# EasyEDA Pro project Targetold1.eprj

# Schematic Schematic1
Create Date: 2022-10-10; Page Name: P1; Project Name: TargetV1; Schematic Name: Schematic1; Update Date: 2022-10-11
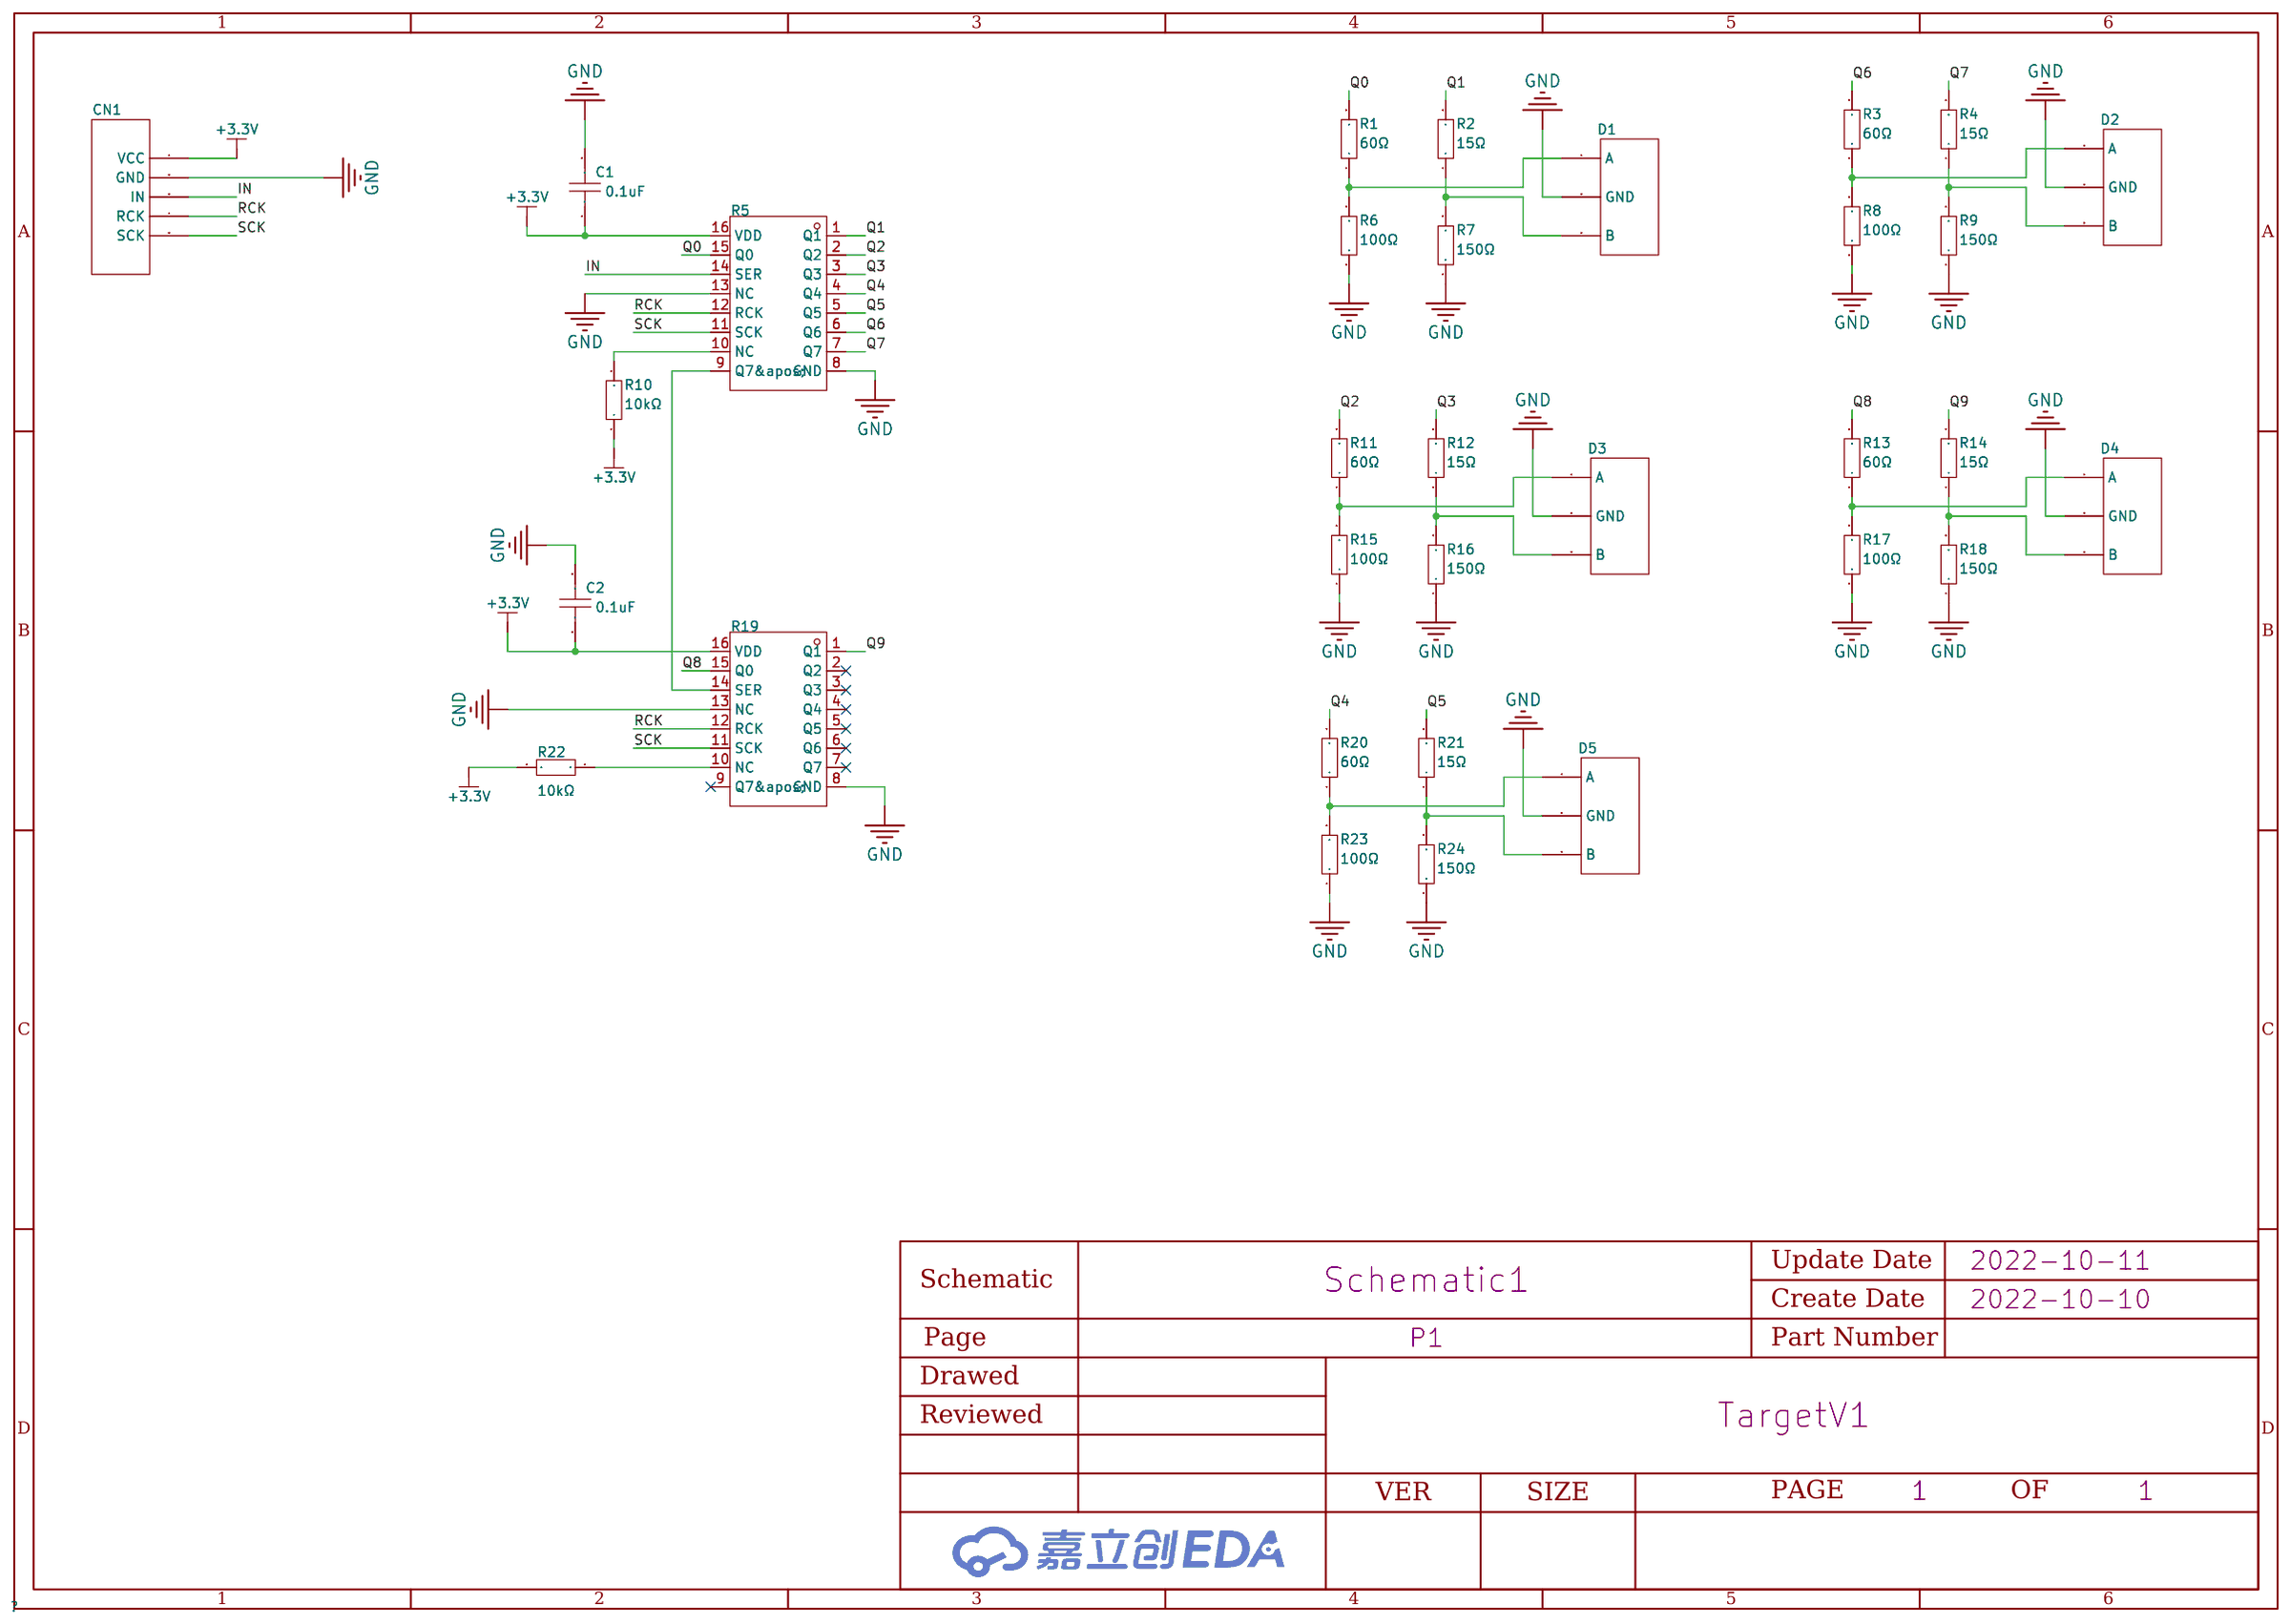
[diagram p0: schematic sheet]

## Parts
C1  0.1uF  [C0603]
C2  0.1uF  [C0603]
CN1  -  [XH2.54-5P]
D1  -  [双色LED-共阴]
D2  -  [双色LED-共阴]
D3  -  [双色LED-共阴]
D4  -  [双色LED-共阴]
D5  -  [双色LED-共阴]
R1  60Ω  [R0603]
R2  15Ω  [R0603]
R3  60Ω  [R0603]
R4  15Ω  [R0603]
R5  74HC595D.  [SOP-16_L9.9-W3.9-P1.27-LS6.0-BL]
R6  100Ω  [R0603]
R7  150Ω  [R0603]
R8  100Ω  [R0603]
R9  150Ω  [R0603]
R10  10kΩ  [R0603]
R11  60Ω  [R0603]
R12  15Ω  [R0603]
R13  60Ω  [R0603]
R14  15Ω  [R0603]
R15  100Ω  [R0603]
R16  150Ω  [R0603]
R17  100Ω  [R0603]
R18  150Ω  [R0603]
R19  74HC595D.  [SOP-16_L9.9-W3.9-P1.27-LS6.0-BL]
R20  60Ω  [R0603]
R21  15Ω  [R0603]
R22  10kΩ  [R0603]
R23  100Ω  [R0603]
R24  150Ω  [R0603]

## Library data of the parts
C1 C2 = CC0603KRX7R9BB104: 容值:100nF;精度:±10%;额定电压:50V;材质(温度系数):X7R;; LCSC Part Name: 100nF ±10% 50V; Supplier Part: C14663; Manufacturer: YAGEO(国巨); Supplier Footprint: 0603; JLCPCB Part Class: Basic Part; Datasheet: https://atta.szlcsc.com/upload/public/pdf/source/20170116/1484561234239.pdf; Supplier: LCSC; Tolerance: ±10%; Voltage Rated: 50V; Temperature Coefficient: X7R
CN1 = XH2.54-5P
D1-D5 = 双色LED-共阴
R1-R4 R6-R18 R20-R24 = 0603WAF1002T5E: 电阻类型:厚膜电阻;阻值:10kΩ;精度:±1%;功率:100mW;温度系数:±100ppm/;最大工作电压:75V;工作温度范围:-55~+155;; LCSC Part Name: 10kΩ ±1% 100mW; Supplier Part: C25804; Manufacturer: UNI-ROYAL(厚声); Supplier Footprint: 0603; JLCPCB Part Class: Basic Part; Datasheet: https://atta.szlcsc.com/upload/public/pdf/source/20200306/C422600_1E6D84923E4A46A82E41ADD87F860B5C.pdf; Supplier: LCSC; Type: 厚膜电阻; Tolerance: ±1%; Power(Watts): 100mW; Temperature Coefficient: ±100ppm/; Overload Voltage (Max): 75V; Operating Temperature Range: -55~+155
R5 R19 = 74HC595D.: Supplier Part: C2929943; Manufacturer: FM(富满); Supplier Footprint: SOP-16; JLCPCB Part Class: Extended Part; Datasheet: https://atta.szlcsc.com/upload/public/pdf/source/20211125/20F1E3849D7C8A7DB346B0C433D530E9.pdf; Supplier: LCSC

## Nets
+3.3V: C1.1 C2.1 CN1.1(VCC) R5.16(VDD) R10.1 R19.16(VDD) R22.2
GND: C1.2 C2.2 CN1.2(GND) D1.2(GND) D2.2(GND) D3.2(GND) D4.2(GND) D5.2(GND) R5.8(GND) R5.13(NC) R6.1 R7.1 R8.1 R9.1 R15.1 R16.1 R17.1 R18.1 R19.8(GND) R19.13(NC) R23.1 R24.1
IN: CN1.3(IN) R5.14(SER)
Q0: R1.2 R5.15(Q0)
Q1: R2.2 R5.1(Q1)
Q2: R5.2(Q2) R11.2
Q3: R5.3(Q3) R12.2
Q4: R5.4(Q4) R20.2
Q5: R5.5(Q5) R21.2
Q6: R3.2 R5.6(Q6)
Q7: R4.2 R5.7(Q7)
Q8: R13.2 R19.15(Q0)
Q9: R14.2 R19.1(Q1)
RCK: CN1.4(RCK) R5.12(RCK) R19.12(RCK)
SCK: CN1.5(SCK) R5.11(SCK) R19.11(SCK)
$1N1102: R5.10(NC) R10.2
$1N1166: R5.9(Q7&apos;) R19.14(SER)
$1N1771: R19.10(NC) R22.1
$1N5350: D1.1(A) R1.1 R6.2
$1N5516: D1.3(B) R2.1 R7.2
$1N6308: D3.1(A) R11.1 R15.2
$1N6309: D3.3(B) R12.1 R16.2
$1N6730: D5.1(A) R20.1 R23.2
$1N6731: D5.3(B) R21.1 R24.2
$1N7312: D2.1(A) R3.1 R8.2
$1N7313: D2.3(B) R4.1 R9.2
$1N7752: D4.1(A) R13.1 R17.2
$1N7753: D4.3(B) R14.1 R18.2

Not connected (* = marked no-connect by the designer): R19 2(Q2)* 3(Q3)* 4(Q4)* 5(Q5)* 6(Q6)* 7(Q7)* 9(Q7&apos;)*

# Board PCB3
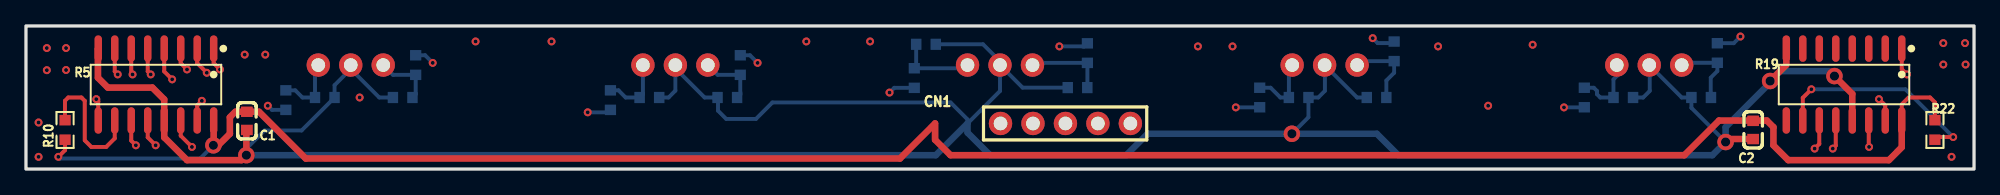
[diagram p1: board, top side]
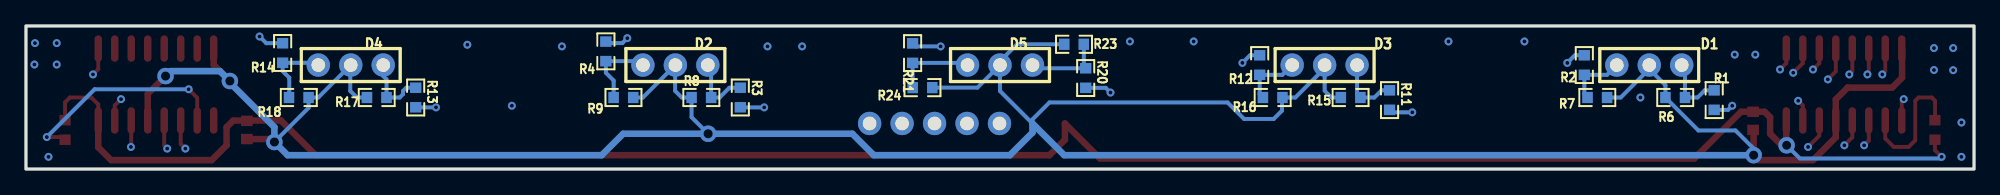
[diagram p2: board, bottom side, seen from below]

Outline 150.02 x 11.02 mm; copper layers: Top Layer, CPU1, CPU2, Bottom Layer. Coordinates in mm from the lower left corner of the outline.
Outline path: rectangle 0,11.02 150.02,0
Stack: Top Layer 0.035mm / Dielectric1 0.48mm PP er 4.5 / CPU1 0.035mm / Dielectric2 0.48mm FR4 er 4.5 / CPU2 0.035mm / Dielectric3 0.48mm PP er 4.5 / Bottom Layer 0.035mm

## Design rules (mm)
spacing safeClearance (default): track to track 0.152, other pairs 0.152 to 0.3
track width trackWidth (default): min 0.127, default 0.254, max 2.54
differential pair differentialPair (default): width min 0.127, default 0.254, max 2.54; gap min 0.152, default 0.152
via viaSize (default): diameter min 0.5, default 0.61, max 10; hole min 0.3, default 0.305, max 6

## Placement (name value [footprint] x y rotation side)
C1  0.1uF  [C0603]  17.01 3.71 270 top
C2  0.1uF  [C0603]  133.01 3.01 270 top
CN1  -  [XH2.54-5P]  75.01 3.51 0 top
D1  -  [双色LED-共阴]  25.01 8.01 180 bottom
D2  -  [双色LED-共阴]  100.01 8.01 180 bottom
D3  -  [双色LED-共阴]  50.01 8.01 180 bottom
D4  -  [双色LED-共阴]  125.01 8.01 180 bottom
D5  -  [双色LED-共阴]  75.01 8.01 180 bottom
R1  60Ω  [R0603]  20.01 5.31 270 bottom
R2  15Ω  [R0603]  30.01 8.01 90 bottom
R3  60Ω  [R0603]  95.01 5.51 270 bottom
R4  15Ω  [R0603]  105.37 9.07 90 bottom
R5  74HC595D.  [SOP-16_L9.9-W3.9-P1.27-LS6.0-BL]  10.01 6.51 180 top
R6  100Ω  [R0603]  23.01 5.51 180 bottom
R7  150Ω  [R0603]  29.01 5.51 0 bottom
R8  100Ω  [R0603]  98.01 5.51 180 bottom
R9  150Ω  [R0603]  104.01 5.51 0 bottom
R10  10kΩ  [R0603]  3.01 3.01 90 top
R11  60Ω  [R0603]  45.01 5.31 270 bottom
R12  15Ω  [R0603]  55.01 8.01 90 bottom
R13  60Ω  [R0603]  120.01 5.51 270 bottom
R14  15Ω  [R0603]  130.26 8.94 90 bottom
R15  100Ω  [R0603]  48.01 5.51 180 bottom
R16  150Ω  [R0603]  54.01 5.51 0 bottom
R17  100Ω  [R0603]  123.01 5.51 180 bottom
R18  150Ω  [R0603]  129.01 5.51 0 bottom
R19  74HC595D.  [SOP-16_L9.9-W3.9-P1.27-LS6.0-BL]  140.01 6.51 180 top
R20  60Ω  [R0603]  68.41 7.01 270 bottom
R21  15Ω  [R0603]  81.74 8.93 90 bottom
R22  10kΩ  [R0603]  147.01 3.01 90 top
R23  100Ω  [R0603]  69.31 9.61 180 bottom
R24  150Ω  [R0603]  80.98 6.27 0 bottom

## Footprints (pads in the part's own frame, mm; a bottom-side part is the same pattern mirrored in y, then rotated)
C0603
  rect 0.8x0.9 smd: 1(-0.7,0) 2(0.7,0)
R0603
  rect 0.806x0.864 smd: 1(-0.753,0) 2(0.753,0)
SOP-16_L9.9-W3.9-P1.27-LS6.0-BL
  oval 0.574x2.038 smd: 1(-4.445,-2.769) 2(-3.175,-2.769) 3(-1.905,-2.769) 4(-0.635,-2.769) 5(0.635,-2.769) 6(1.905,-2.769) 7(3.175,-2.769) 8(4.445,-2.769) 9(4.445,2.769) 10(3.175,2.769) 11(1.905,2.769) 12(0.635,2.769) 13(-0.635,2.769) 14(-1.905,2.769) 15(-3.175,2.769) 16(-4.445,2.769)
XH2.54-5P
  round 1.8 hole 1.05: 1(0.04,0) 2(2.54,0) 3(5.04,0) 4(7.54,0) 5(10.04,0)
双色LED-共阴
  round 1.8 hole 1.05: 1(2.5,0) 2(0,0) 3(-2.5,0)

## Nets
As in the schematic.

Pads without a net: R19 2 3 4 5 6 7 9

## Via types
v1: diameter 0.61, hole 0.305, Top Layer to Bottom Layer, 53 vias
v2: diameter 1.27, hole 0.711, Top Layer to Bottom Layer, 5 vias
v3: diameter 1.27, hole 0.7, Top Layer to Bottom Layer, 1 via

## Routing (per net, layer and track width the routed paths; a pad name or vN(x,y) marks a point on that pad's centre or on a via; arc(x,y) is an arc through that point)
+3.3V: length 163.3
  Top Layer w0.3: v1(2.5,0.94) 3.01,1.46 R10.1 ; R22.2 147.01,5.14 146.64,5.51 144.99,5.51 144.46,4.98 R19.16
  Top Layer w0.5: R19.16 144.46,1.68 143.47,0.69 135.72,0.69 134.57,1.83 134.57,3.23 134.07,3.73 133.03,3.73 C2.1 132.99,3.73 130.38,3.73 127.72,1.07 71.2,1.07 70.01,2.26 70.01,3.51 67.31,0.81 21.55,0.81 17.95,4.41 C1.1 16.13,4.41 15.7,3.99 15.7,2.72 14.81,1.83 v3(14.43,1.83) 14.46,1.85 R5.16
  Bottom Layer w0.3: v3(14.43,1.83) 13.42,0.81 2.62,0.81 v1(2.5,0.94)
GND: length 245.2
  Top Layer w0.5: C2.2 131.12,2.31 v2(130.89,2.08) ; R19.13 140.65,5.79 v2(139.27,7.16) ; R19.8 135.57,8.03 v2(134.32,6.78) ; R5.8 5.54,9.26 5.54,7.04 6.31,6.27 9.73,6.27 10.65,5.36 R5.13 10.65,2.44 12.4,0.69 16.59,0.69 v2(16.97,1.07) 16.97,2.97 C1.2
  Bottom Layer w0.3: 50.01,7.76 52.26,5.51 R16.1 53.29,5.48 53.29,4.5 53.93,3.86 56.22,3.86 57.49,5.13 71.2,5.13 72.51,3.82 72.51,3.51 75.01,6.01 D5.2 ; 50.01,7.76 D3.2 ; 50.01,7.76 50.01,6.04 49.48,5.51 R15.1 ; R17.1 124.54,5.51 125.05,6.02 125.05,7.97 ; 100.03,7.99 D2.2 ; 100.03,7.99 100.03,6.02 99.52,5.51 R8.1 98.77,3.99 v2(97.49,2.72) ; 100.03,7.99 102.51,5.51 R9.1 ; 25.01,7.71 D1.2 ; 25.01,7.71 23.77,6.46 R6.1 21.23,2.97 18.37,2.97 16.97,1.58 v2(16.97,1.07) ; 25.01,7.71 27.21,5.51 R7.1 ; R23.1 73.71,9.61 75.01,8.31 D5.2 ; R24.1 76.75,6.27 D5.2 ; 125.05,7.97 D4.2 ; 125.05,7.97 127.51,5.51 R18.1 128.26,4.72 v2(130.89,2.08)
  Bottom Layer w0.5: v2(139.27,7.16) 138.89,7.54 135.08,7.54 v2(134.32,6.78) 134.32,6.66 130.89,3.23 v2(130.89,2.08) 129.88,1.07 105.68,1.07 104.03,2.72 v2(97.49,2.72) 86.38,2.72 84.73,1.07 74.25,1.07 72.51,2.81 72.51,3.51 70.07,1.07 v2(16.97,1.07)
  vias: v1(0.97,3.59) v1(0.97,0.94) v1(1.61,9.32) v1(1.61,7.62) v1(3.09,9.32) v1(3.09,7.63) v1(16.85,8.81) v1(18.43,8.81) v1(25.7,5.51) v1(34.63,9.83) v1(40.47,9.83) v1(60.1,9.83) v1(65.01,9.83) v1(90.25,9.45) v1(92.92,9.45) v1(108.75,9.45) v1(112.6,4.88) v1(116.03,9.58) v1(147.66,9.7) v1(147.66,8.05) v1(148.29,0.94) v1(149.33,9.7) v1(149.37,8.05)
IN: length 67.6
  Top Layer w0.3: R5.14 11.92,2.57 v1(12.78,1.7)
  CPU1 w0.3: v1(12.78,1.7) 15.07,3.99 21.42,3.99 23.58,1.83 74.12,1.83 75.01,2.72 75.01,3.51
Q0: length 8.4
  Top Layer w0.3: v1(13.54,5.26) 13.19,4.9 R5.15
  CPU1 w0.3: v1(18.62,4.88) 18.24,5.26 v1(13.54,5.26)
  Bottom Layer w0.3: v1(18.62,4.88) 18.94,4.56 R1.2
Q1: length 21.1
  Top Layer w0.3: R5.1 14.46,8.16 v1(14.94,7.67)
  CPU1 w0.3: v1(31.32,8.18) 29.93,9.58 21.42,9.58 19.51,7.67 v1(14.94,7.67)
  Bottom Layer w0.3: R2.2 30.74,8.77 v1(31.32,8.18)
Q2: length 34.6
  Top Layer w0.3: R5.2 13.19,8.16 v1(13.92,7.42)
  CPU1 w0.3: v1(13.92,7.42) 14.31,7.04 21.16,7.04 23.83,4.37 v1(43.26,4.37)
  Bottom Layer w0.3: v1(43.26,4.37) 44.82,4.37 R11.2
Q3: length 52.8
  Top Layer w0.3: R5.3 11.92,8.16 v1(12.4,7.67)
  CPU1 w0.3: v1(12.4,7.67) 14.81,10.08 30.56,10.08 35.52,5.13 41.48,5.13 45.93,9.58 54.95,9.58 v1(56.34,8.18)
  Bottom Layer w0.3: R12.2 55.76,8.77 v1(56.34,8.18)
Q4: length 62.2
  Top Layer w0.3: R5.4 10.65,7.52 v1(11.26,6.91)
  CPU1 w0.3: v1(66.5,5.89) 64.22,3.61 23.7,3.61 20.78,6.53 11.64,6.53 v1(11.26,6.91)
  Bottom Layer w0.3: v1(66.5,5.89) 66.87,6.26 R20.2
Q5: length 83.2
  Top Layer w0.3: R5.5 9.38,7.52 v1(9.61,7.29)
  CPU2 w0.3: v1(79.58,9.45) 68.79,9.45 64.22,4.88 60.66,4.88 55.96,9.58 46.18,9.58 41.48,4.88 35.77,4.88 30.82,9.83 12.15,9.83 v1(9.61,7.29)
  Bottom Layer w0.3: v1(79.58,9.45) 81.51,9.45 R21.2
Q6: length 92.4
  Top Layer w0.3: v1(8.21,7.29) 8.11,7.39 R5.6
  CPU1 w0.3: v1(8.21,7.29) 9.48,6.02 20.4,6.02 23.58,2.84 64.98,2.84 68.03,5.89 84.66,5.89 85.81,4.75 v1(93.17,4.75)
  Bottom Layer w0.3: R3.2 95,4.75 v1(93.17,4.75)
Q7: length 113.6
  Top Layer w0.3: R5.7 6.84,7.52 v1(7.07,7.29)
  CPU2 w0.3: v1(7.07,7.29) 10.11,10.34 31.07,10.34 35.9,5.51 40.85,5.51 45.55,10.21 56.22,10.21 60.91,5.51 64.09,5.51 68.79,10.21 81.11,10.21 85.93,5.39 92.41,5.39 97.11,10.08 v1(103.71,10.08)
  Bottom Layer w0.3: v1(103.71,10.08) 104.09,9.7 105.25,9.7 R4.2
Q8: length 27.9
  Top Layer w0.3: R19.15 143.19,4.9 v1(142.7,5.39)
  CPU1 w0.3: v1(142.7,5.39) 119.08,5.39 v1(118.45,4.75)
  Bottom Layer w0.3: R13.2 120,4.75 v1(118.45,4.75)
Q9: length 18.2
  Top Layer w0.3: R19.1 144.46,7.7 v1(144.86,7.29)
  CPU1 w0.3: v1(144.86,7.29) 141.94,10.21 v1(132.03,10.21)
  Bottom Layer w0.3: R14.2 131.52,9.69 v1(132.03,10.21)
RCK: length 139.8
  Top Layer w0.3: v1(9.99,1.83) 9.38,2.44 R5.12 ; R19.12 139.38,1.81 v1(139.15,1.58)
  CPU2 w0.3: 77.55,3.86 78.69,5 81.62,5 82.89,3.73 136.99,3.73 v1(139.15,1.58) ; 77.55,3.86 77.55,3.55 77.51,3.51 ; 77.55,3.86 77.55,4.88 76.92,5.51 68.15,5.51 65.36,2.72 43.26,2.72 41.86,4.11 12.27,4.11 v1(9.99,1.83)
SCK: length 138.2
  Top Layer w0.3: v1(137.75,1.58) 138.11,1.93 R19.11 ; v1(8.46,1.83) 8.11,2.19 R5.11
  CPU1 w0.3: v1(137.75,1.58) 135.34,1.58 133.18,3.73 80.23,3.73 80.01,3.51
  CPU2 w0.3: 80.01,3.51 80.01,2.38 79.33,1.7 43.39,1.7 41.48,3.61 13.42,3.61 10.88,1.07 9.23,1.07 v1(8.46,1.83)
$1N1102: length 10.5
  Top Layer w0.3: R10.2 3,3.77 3,5.26 3.26,5.51 4.27,5.51 4.53,5.26 4.53,2.21 5.03,1.7 6.18,1.7 6.84,2.36 R5.10
$1N1166: length 147.2
  Top Layer w0.3: R5.9 5.57,5.23 v1(5.42,5.39) ; v1(141.94,1.7) 141.92,1.73 R19.14
  CPU2 w0.3: v1(5.42,5.39) 5.42,3.61 8.46,0.56 14.81,0.56 16.59,2.34 41.48,2.34 42.88,0.94 127.08,0.94 129.37,3.23 134.57,3.23 137.12,0.69 141.18,0.69 141.94,1.45 v1(141.94,1.7)
$1N1771: length 16.6
  Top Layer w0.3: v1(137.5,6.15) 136.84,5.49 R19.10 ; R22.1 147.22,2.46 v1(148.42,2.46)
  Bottom Layer w0.3: v1(137.5,6.15) 144.74,6.15 v1(148.42,2.46)
$1N5350: length 5.1
  Bottom Layer w0.3: D1.1 22.26,7.76 R6.2 21.29,5.51 20.74,6.07 R1.1
$1N5516: length 4.7
  Bottom Layer w0.3: D1.3 28.27,7.26 R2.1 30.01,5.76 R7.2
$1N6308: length 5.1
  Bottom Layer w0.3: D3.1 47.51,5.77 R15.2 46.18,5.51 45.63,6.07 R11.1
$1N6309: length 4.7
  Bottom Layer w0.3: R16.2 55.01,5.76 R12.1 53.27,7.26 D3.3
$1N6730: length 6.1
  Bottom Layer w0.3: D5.1 72.27,7.77 R20.1 68.56,7.91 R23.2
$1N6731: length 6.2
  Bottom Layer w0.3: R24.2 81.74,6.28 R21.1 77.68,8.18 D5.3
$1N7312: length 5.2
  Bottom Layer w0.3: R3.1 95.85,6.27 96.6,5.51 R8.2 97.26,7.76 D2.1
$1N7313: length 6
  Bottom Layer w0.3: R9.2 104.77,6.82 105.37,7.42 R4.1 102.81,8.31 D2.3
$1N7752: length 5.3
  Bottom Layer w0.3: R13.1 120.74,6.27 120.99,6.02 120.99,5.77 121.24,5.51 R17.2 122.26,5.51 122.26,6.91 122.51,7.17 D4.1
$1N7753: length 5.7
  Bottom Layer w0.3: D4.3 127.69,8.19 R14.1 130.26,7.54 129.75,7.04 129.75,5.53 R18.2

## Copper pours and planes (outline as drawn; the poured copper is in the pictures)
GND on Top Layer: 0,11.02 150.02,11.02 150.02,0 0,0
GND on Bottom Layer: 0,11.02 150.02,11.02 150.02,0 0,0
